# EAGLE schematic mono mainB revB (EAGLE 7.4.0)
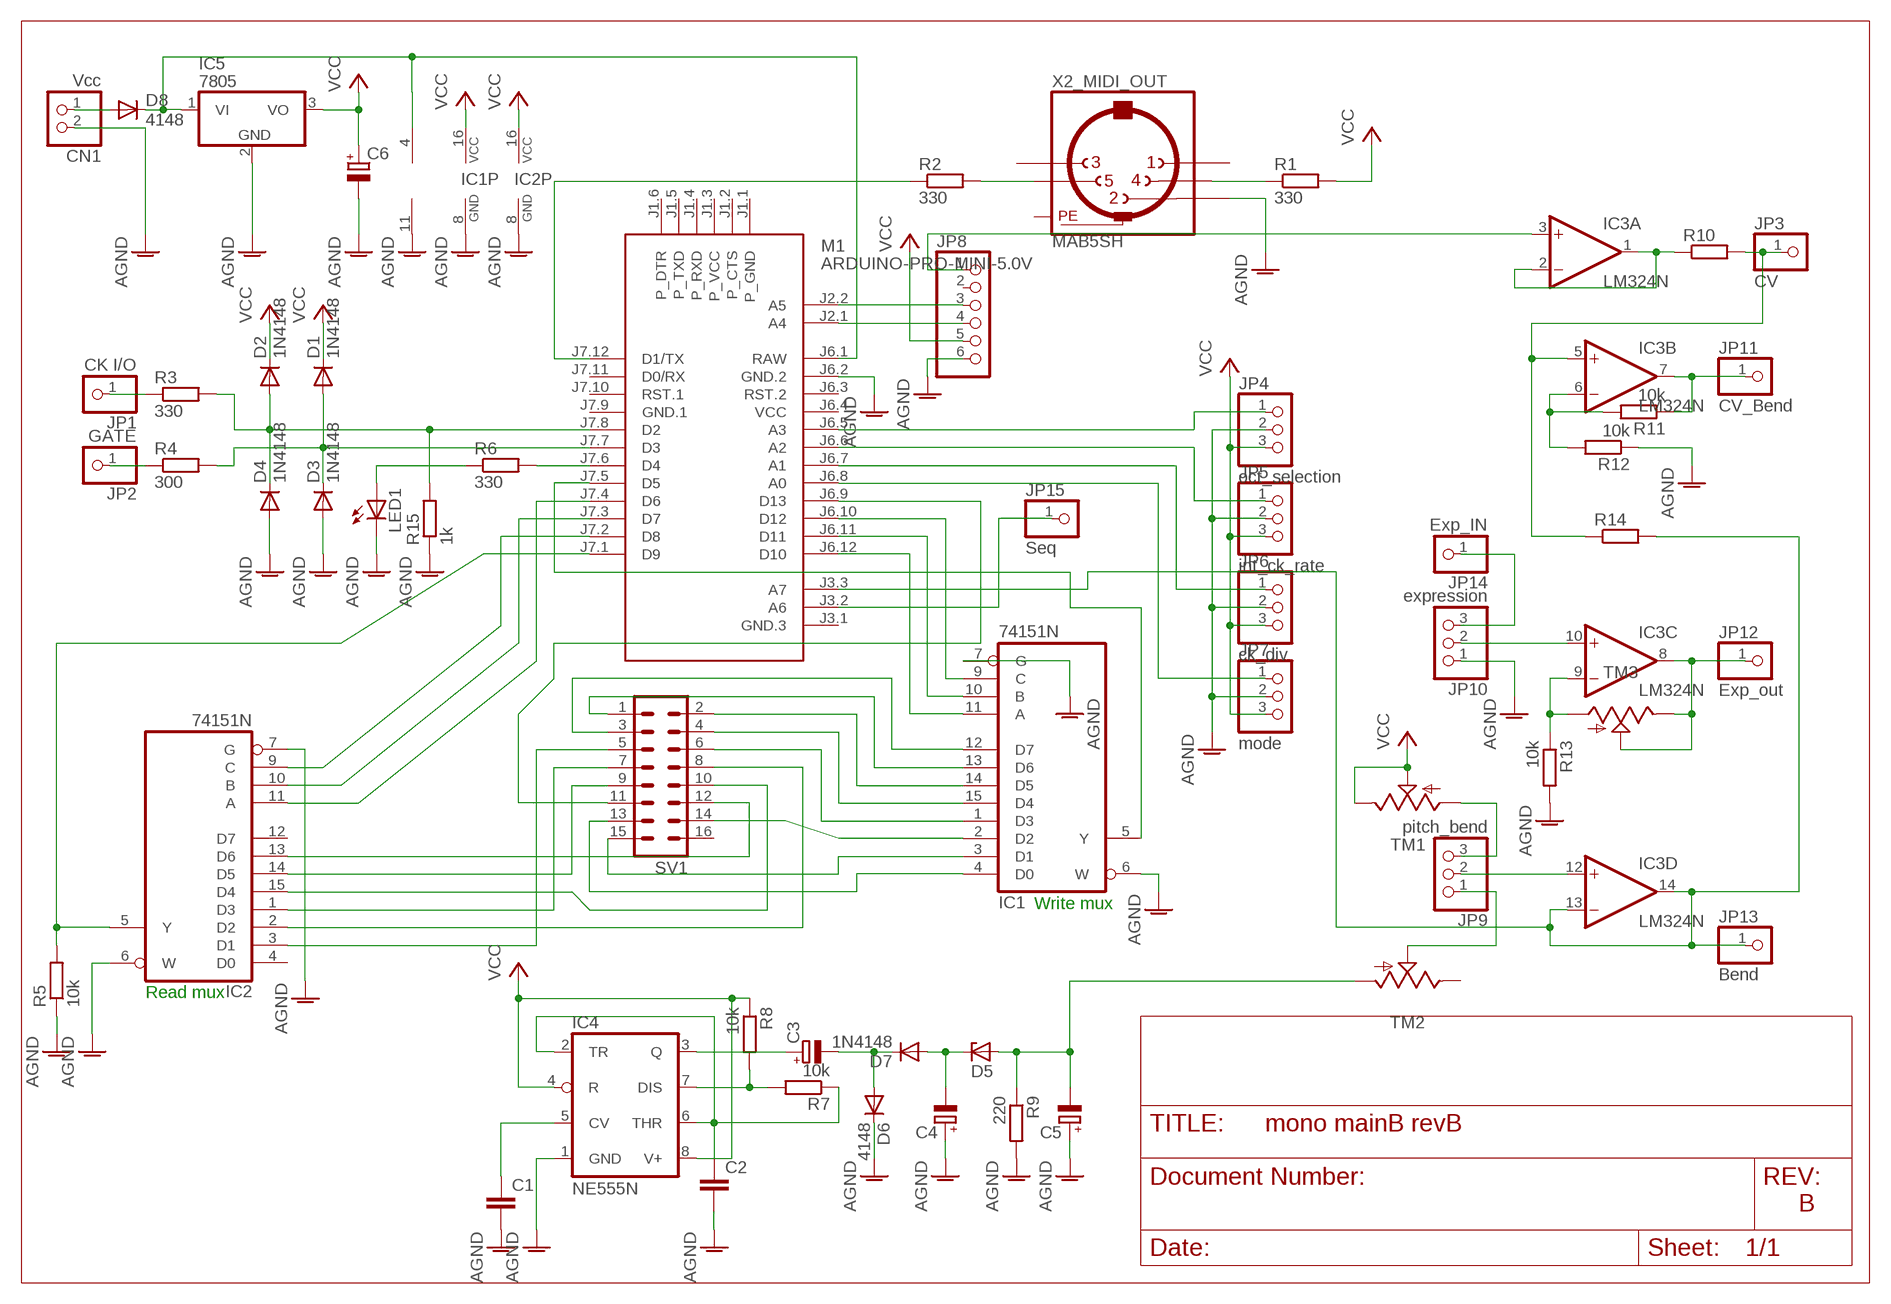
[diagram p0: schematic, sheet 1]

## Parts
C1  C-EU050-025X075  [C050-025X075]
C2  C-EU050-025X075  [C050-025X075]
C3  CPOL-EUE5-8.5  [E5-8,5]
C4  CPOL-EUE5-8.5  [E5-8,5]
C5  CPOL-EUE5-8.5  [E5-8,5]
C6  CPOL-EUE5-8.5  [E5-8,5]
CN1  Vcc  JST_2PIN-THM  [JST-PH-2-THM]
D1  1N4148  1N4148DO35-7  [DO35-7]
D2  1N4148  1N4148DO35-7  [DO35-7]
D3  1N4148  1N4148DO35-7  [DO35-7]
D4  1N4148  1N4148DO35-7  [DO35-7]
D5  ZENER-DIODEZD-7.5  [ZDIO-7.5]
D6  4148  1N4148DO35-7  [DO35-7]
D7  1N4148  1N4148DO35-7  [DO35-7]
D8  4148  1N4148DO35-7  [DO35-7]
IC1  74151N  [DIL16]
IC2  74151N  [DIL16]
IC3  LM324N  [DIL14]
IC4  NE555N  [DIL08-ROUND]
IC5  7805  7805TV  [TO220V]
JP1  CK I/O  PINHD-1X1  [1X01]
JP2  GATE  PINHD-1X1  [1X01]
JP3  CV  PINHD-1X1  [1X01]
JP4  oct_selection  PINHD-1X3  [1X03]
JP5  int_ck_rate  PINHD-1X3  [1X03]
JP6  ck_div  PINHD-1X3  [1X03]
JP7  mode  PINHD-1X3  [1X03]
JP8  PINHD-1X6  [1X06]
JP9  pitch_bend  PINHD-1X3  [1X03]
JP10  expression  PINHD-1X3  [1X03]
JP11  CV_Bend  PINHD-1X1  [1X01]
JP12  Exp_out  PINHD-1X1  [1X01]
JP13  Bend  PINHD-1X1  [1X01]
JP14  Exp_IN  PINHD-1X1  [1X01]
JP15  Seq  PINHD-1X1  [1X01]
LED1  LED5MM  [LED5MM]
M1  ARDUINO-PRO-MINI-5.0V  [ARDUINO-PRO-MINI]
R1  330  R-EU_0204/2V  [0204V]
R2  330  R-EU_0204/7  [0204/7]
R3  330  R0204/7  [0204/7]
R4  300  R0204/7  [0204/7]
R5  10k  R-EU_0204/7  [0204/7]
R6  330  R-EU_0207/10  [0207/10]
R7  10k  R-EU_0204/2V  [0204V]
R8  10k  R-EU_0204/2V  [0204V]
R9  220  R-EU_0204/2V  [0204V]
R10  R0204/7  [0204/7]
R11  10k  R-EU_0204/2V  [0204V]
R12  10k  R-EU_0207/10  [0207/10]
R13  10k  R-EU_0207/10  [0207/10]
R14  R0204/7  [0204/7]
R15  1k  R0204/7  [0204/7]
SV1  MA08-2  [MA08-2]
TM1  TRIM  [6MM]
TM2  TRIM  [6MM]
TM3  TRIM  [6MM]
X2_MIDI_OUT  MAB5SH  [MAB5SH]

## Nets
AGND: C1.2 C2.2 C4.+ C5.+ C6.- CN1.2 D3.A D4.A D6.C IC1.6(W) IC1.7(G) IC1.8(GND) IC2.6(W) IC2.7(G) IC2.8(GND) IC3.11(P:V-) IC4.1(GND) IC5.2(GND) JP4.2 JP5.2 JP6.2 JP7.2 JP8.6 JP10.1 LED1.K(C) M1.J6.2(GND.2) R5.1 R9.2 R12.1 R13.2 R15.1 X2_MIDI_OUT.2
N$1: IC1.12(D7) SV1.3
N$2: IC1.13(D6) SV1.1
N$3: IC1.14(D5) SV1.2
N$4: IC1.15(D4) SV1.4
N$5: IC1.1(D3) SV1.6
N$6: IC1.4(D0) SV1.13
N$7: IC1.2(D2) SV1.14
N$8: IC1.3(D1) SV1.15
N$11: IC2.13(D6) SV1.12
N$12: IC2.14(D5) SV1.9
N$13: IC2.15(D4) SV1.10
N$14: IC2.1(D3) SV1.7
N$15: IC2.2(D2) SV1.8
N$16: JP1.1 R3.1
N$17: IC1.11(A) M1.J6.12(D10)
N$18: IC1.10(B) M1.J6.11(D11)
N$19: M1.J7.12(D1/TX) R2.1
N$20: IC2.3(D1) SV1.5
N$21: JP8.3 M1.J2.2(A5)
N$22: D2.A D4.C M1.J7.8(D2) R3.2 R15.2
N$23: D1.A D3.C M1.J7.7(D3) R4.2
N$24: IC2.5(Y) M1.J7.1(D9) R5.2
N$25: IC1.5(Y) M1.J7.5(D5)
N$26: JP6.1 M1.J6.7(A1)
N$27: JP5.1 M1.J6.6(A2)
N$28: JP2.1 R4.1
N$29: JP8.4 M1.J2.1(A4)
N$30: R2.2 X2_MIDI_OUT.5
N$31: R1.1 X2_MIDI_OUT.4
N$33: IC3.9(C:-IN) R13.1 TM3.A
N$34: JP4.1 M1.J6.5(A3)
N$35: IC2.9(C) M1.J7.2(D8)
N$36: IC2.10(B) M1.J7.3(D7)
N$37: IC2.11(A) M1.J7.4(D6)
N$38: LED1.A R6.1
N$39: M1.J7.6(D4) R6.2
N$40: IC4.7(DIS) R7.2 R8.2
N$41: C2.1 IC4.2(TR) IC4.6(THR) R7.1
N$42: C1.1 IC4.5(CV)
N$43: IC3.1(A:OUT) IC3.2(A:-IN) R10.1
N$44: C3.+ IC4.3(Q)
N$45: C3.- D6.A D7.C
N$46: C4.- D5.C D7.A
N$47: C5.- D5.A R9.1 TM2.A
N$48: IC3.12(D:+IN) JP9.2
N$49: IC3.13(D:-IN) IC3.14(D:OUT) JP13.1 M1.J3.3(A7) R14.2
N$50: JP9.3 TM1.A
N$51: IC3.10(C:+IN) JP10.2
N$52: IC3.8(C:OUT) JP12.1 TM3.E TM3.S
N$53: CN1.1 D8.A
N$54: JP9.1 TM2.S
N$55: IC3.6(B:-IN) R11.2 R12.2
N$56: IC3.7(B:OUT) JP11.1 R11.1
N$57: D8.C IC3.4(P:V+) IC5.1(VI) M1.J6.1(RAW)
N$58: IC1.9(C) M1.J6.10(D12)
N$59: IC3.3(A:+IN) JP8.1
N$60: IC3.5(B:+IN) JP3.1 R10.2 R14.1
N$61: JP10.3 JP14.1
N$62: M1.J6.9(D13) SV1.11
N$67: JP7.1 M1.J6.8(A0)
N$70: JP15.1 M1.J3.2(A6)
VCC: C6.+ D1.C D2.C IC1.16(VCC) IC2.16(VCC) IC4.4(R) IC4.8(V+) IC5.3(VO) JP4.3 JP5.3 JP6.3 JP7.3 JP8.5 R1.2 R8.1 TM1.E TM1.S
Unconnected: IC2.4(D0) IC2.12(D7) JP8.2 M1.J1.1(P_GND) M1.J1.2(P_CTS) M1.J1.3(P_VCC) M1.J1.4(P_RXD) M1.J1.5(P_TXD) M1.J1.6(P_DTR) M1.J3.1(GND.3) M1.J6.3(RST.2) M1.J7.10(RST.1) M1.J7.11(D0/RX) SV1.16 TM2.E X2_MIDI_OUT.1 X2_MIDI_OUT.3

## Notes on the sheet
- Write mux
- Read mux
- B

## Power pins joined to a net without a drawn wire
GND.1: M1.J7.9(GND.1)
PE: X2_MIDI_OUT.PE X2_MIDI_OUT.PE@(PE)
VCC: M1.J6.4(VCC)

## Library data of the parts
C1 C2 = rcl:C-EU: CAPACITOR, European symbol
C3-C6 = rcl:CPOL-EU: POLARIZED CAPACITOR, European symbol
CN1 = adafruit:JST_2PIN: JST 2-Pin Connectors of various flavors SMT-RA (S2B-PH-SM4) 4UConnector #17311 SMT (B2B-PH-SM4) THM-RA (S2B-PH) THM (B2B-PH)
D1-D4 D6-D8 = diode:1N4148: DIODE high speed (Philips)
D5 = diode:ZENER-DIODE: Z-Diode
IC1 IC2 = 74xx-eu:74*151: Data SELECTOR/MULTIPLEXER
IC3 = linear:LM324: OP AMP
IC4 = adafruit:*555: TIMER Changed DIP package to have round (not oval) pin pads http://www.ladyada.net/library/pcb/eaglelibrary.html
IC5 = linear:78*: Positive VOLTAGE REGULATOR Source: http://cache.national.com/ds/LM/LM78L05.pdf http://www.fairchildsemi.com/ds/LM/LM7805.pdf
JP1-JP3 JP11-JP15 = adafruit:PINHD-1X1: Pin header 1x1 for 0.1" spacing With round pins
JP4-JP7 JP9 JP10 = adafruit:PINHD-1X3: PIN HEADER
JP8 = adafruit:PINHD-1X6: PIN HEADER
LED1 = adafruit:LED: LED OSRAM: - CHIPLED LG R971, LG N971, LY N971, LG Q971, LY Q971, LO R971, LY R971 LH N974, LH R974 LS Q976, LO Q976, LY Q976 LO Q996 - Hyper CHIPLED LW Q18S LB Q993, LB Q99A, LB R99A - SideLED LS A670, LO A670, LY A670, LG A670, LP A670 LB A673, LV A673, LT A673, LW A673 LH A674 LY A675 LS A676, LA A676, LO A676, LY A676, LW A676 LS A679, LY A679, LG A679 - Hyper Micro SIDELED® LS Y876, LA Y876, LO Y876, LY Y876 LT Y87S - SmartLED LW L88C, LW L88S LB L89C, LB L89S, LG L890 LS L89K, LO L89K, LY L89K LS L896, LA L896, LO L896, LY L896 - TOPLED LS T670, LO T670, LY T670, LG T670, LP T670 LSG T670, LSP T670, LSY T670, LOP T670, LYG T670 LG T671, LOG T671, LSG T671 LB T673, LV T673, LT T673, LW T673 LH T674 LS T676, LA T676, LO T676, LY T676, LB T676, LH T676, LSB T676, LW T676 LB T67C, LV T67C, LT T67C, LS T67K, LO T67K, LY T67K, LW E67C LS E67B, LA E67B, LO E67B, LY E67B, LB E67C, LV E67C, LT E67C LW T67C LS T679, LY T679, LG T679 LS T770, LO T770, LY T770, LG T770, LP T770 LB T773, LV T773, LT T773, LW T773 LH T774 LS E675, LA E675, LY E675, LS T675 LS T776, LA T776, LO T776, LY T776, LB T776 LHGB T686 LT T68C, LB T68C - Hyper Mini TOPLED® LB M676 - Mini TOPLED Santana® LG M470 LS M47K, LO M47K, LY M47K Source: http://www.osram.convergy.de/
M1 = diy-modules:ARDUINO-PRO-MINI-*: Arduino Pro Mini and compatible devices More details available here: https://www.arduino.cc/en/Main/ArduinoBoardProMini Click here to find device on ebay.com <http://www.ebay.com/sch/arduino+pro+mini>
R1 R2 R5-R9 R11-R13 = rcl:R-EU_: RESISTOR, European symbol
R3 R4 R10 R14 R15 = eagle-ltspice:R: RESISTOR, European symbol; SPICEMODEL: NONE; SPICEPREFIX: R
SV1 = con-lstb:MA08-2: PIN HEADER; OC_FARNELL: unknown; OC_NEWARK: unknown
TM1-TM3 = adafruit:TRIM
X2_MIDI_OUT = con-hirschmann:MAB5SH: Female CONNECTOR 5 pins 90 deg. with shield, horizontal (DIN 41524); OC_FARNELL: 809883; OC_NEWARK: unknown